# EAGLE design Arduino-Pro-Mini (EAGLE 7.3.0)
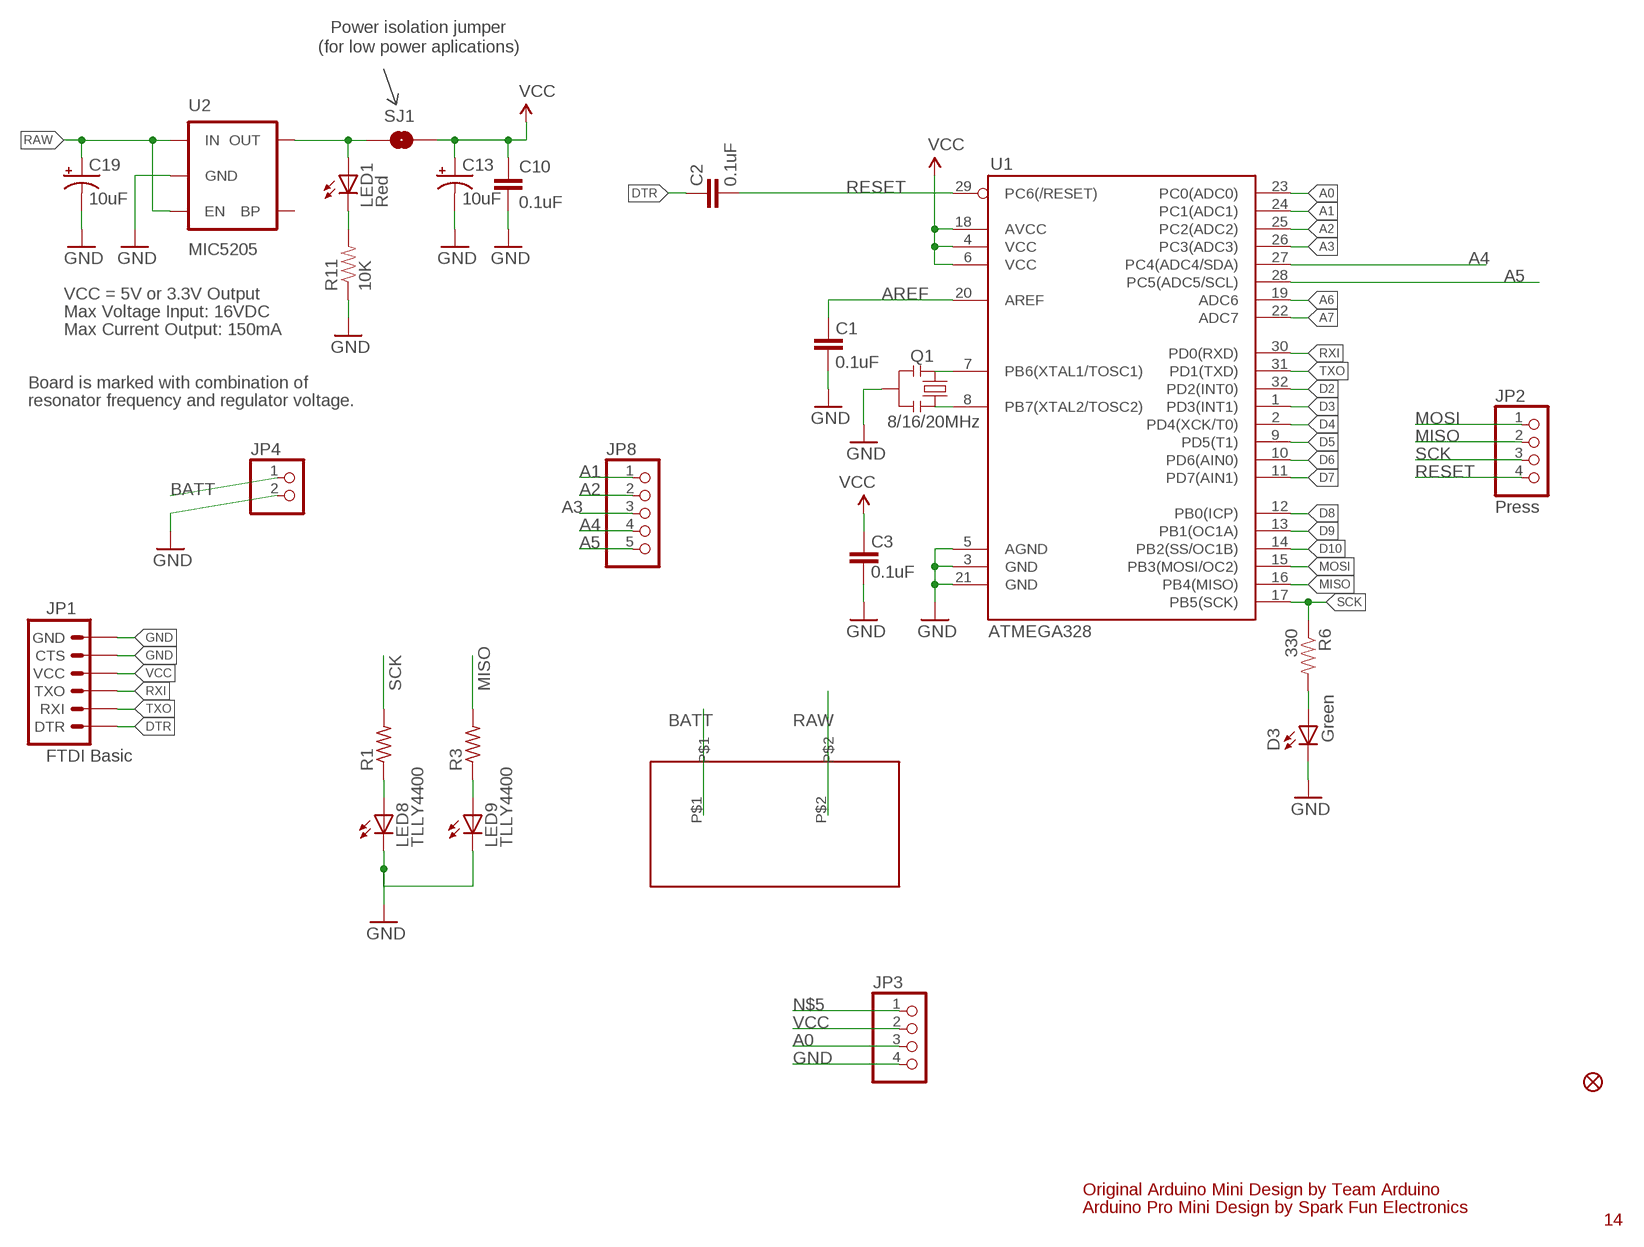
[diagram p0: schematic, sheet 1]

## Parts
C1  0.1uF  CAP0603-CAP  [0603-CAP]
C2  0.1uF  CAP0603-CAP  [0603-CAP]
C3  0.1uF  CAP0603-CAP  [0603-CAP]
C10  0.1uF  CAP0603-CAP  [0603-CAP]
C13  10uF  CAP_POL1206  [EIA3216]
C19  10uF  CAP_POL1206  [EIA3216]
D3  Green  LED  [0603-LED-ALT1]
JP1  FTDI Basic  ARDUINO_SERIAL_PROGRAMPTH  [1X06]
JP2  Press  PINHD-1X4  [1X04]
JP3  PINHD-1X4  [1X04]
JP4  PINHD-1X2  [1X02]
JP5  FIDUCIALUFIDUCIAL  [MICRO-FIDUCIAL]
JP8  PINHD-1X5  [1X05]
LED1  Red  LED  [0603-LED-ALT1]
LED8  TLLY4400  [LED3MM]
LED9  TLLY4400  [LED3MM]
Q1  8/16/20MHz  RESONATOR1:1  [RESONATOR-SMD-1:1]
R1  R-US_R0603  [R0603]
R3  R-US_R0603  [R0603]
R6  330  RESISTOR0603-RES  [0603-RES]
R11  10K  RESISTOR0603-RES  [0603-RES]
SJ1  SOLDERJUMPERNC  [SJ_2S]
U1  ATMEGA328  ATMEGA168  [TQFP32-08]
U2  MIC5205  V_REG_LDOSMD  [SOT23-5]
U$1  SWITCH-DW182  [SWITCH-CW182]

## Nets
A0: JP3.3 U1.23(PC0(ADC0))
A1: JP8.1 U1.24(PC1(ADC1))
A2: JP8.2 U1.25(PC2(ADC2))
A3: JP8.3 U1.26(PC3(ADC3))
A4: JP8.4 U1.27(PC4(ADC4/SDA))
A5: JP8.5 U1.28(PC5(ADC5/SCL))
A6: U1.19(ADC6)
A7: U1.22(ADC7)
AREF: C1.2 U1.20(AREF)
BATT [vcc]: JP4.1 U$1.P$1
D2: U1.32(PD2(INT0))
D3: U1.1(PD3(INT1))
D4: U1.2(PD4(XCK/T0))
D5: U1.9(PD5(T1))
D6: U1.10(PD6(AIN0))
D7: U1.11(PD7(AIN1))
D8: U1.12(PB0(ICP))
D9: U1.13(PB1(OC1A))
D10: U1.14(PB2(SS/OC1B))
DTR: C2.2 JP1.1(DTR)
GND [vcc]: C1.1 C3.1 C10.2 C13.C(-) C19.C(-) D3.C JP1.5(CTS) JP1.6(GND) JP3.4 JP4.2 LED8.K(C) LED9.K(C) Q1.2 R11.1 U1.3(GND) U1.5(AGND) U1.21(GND) U2.2(GND)
MISO: JP2.2 R3.2 U1.16(PB4(MISO))
MOSI: JP2.1 U1.15(PB3(MOSI/OC2))
N$1: Q1.3 U1.8(PB7(XTAL2/TOSC2))
N$2: Q1.1 U1.7(PB6(XTAL1/TOSC1))
N$3: LED1.A SJ1.1 U2.5(OUT)
N$4: LED1.C R11.2
N$5: JP3.1
N$7: D3.A R6.2
N$9: LED8.A R1.1
N$16: LED9.A R3.1
RAW [vcc]: C19.A(+) U2.1(IN) U2.3(EN) U$1.P$2
RESET: C2.1 JP2.4 U1.29(PC6(/RESET))
RXI: JP1.3(TXO) U1.30(PD0(RXD))
SCK: JP2.3 R1.2 R6.1 U1.17(PB5(SCK))
TXO: JP1.2(RXI) U1.31(PD1(TXD))
VCC: C3.2 C10.1 C13.A(+) JP1.4(VCC) JP3.2 SJ1.2 U1.4(VCC) U1.6(VCC) U1.18(AVCC)
Unconnected: U2.4(BP)

## Notes on the sheet
- Power isolation jumper
- (for low power aplications)
- VCC = 5V or 3.3V Output
- Max Voltage Input: 16VDC
- Max Current Output: 150mA
- Board is marked with combination of
- resonator frequency and regulator voltage.
- Original Arduino Mini Design by Team Arduino
- Arduino Pro Mini Design by Spark Fun Electronics
- 14

## Library data of the parts
C1-C3 C10 = SparkFun:CAP: Capacitor Standard 0603 ceramic capacitor, and 0.1" leaded capacitor.
C13 C19 = SparkFun:CAP_POL: Capacitor Polarized These are standard SMD and PTH capacitors. Normally 10uF, 47uF, and 100uF in electrolytic and tantalum varieties. Always verify the external diameter of the through hole cap, it varies with capacity, voltage, and manufacturer. The EIA devices should be standard.
D3 LED1 = Testing:LED: LEDs Standard schematic elements and footprints for 5mm, 3mm, 1206, and 0603 sized LEDs. 5mm - Spark Fun Electronics SKU : COM-00529 (and others)
JP1 = SparkFun:ARDUINO_SERIAL_PROGRAM
JP2 JP3 = pinhead:PINHD-1X4: PIN HEADER
JP4 = pinhead:PINHD-1X2: PIN HEADER
JP5 = SparkFun:FIDUCIAL: Fiducial Alignment Points Various fiducial points for machine vision alignment.
JP8 = pinhead:PINHD-1X5: PIN HEADER
LED8 LED9 = led:TLLY4400: Low Current (2mA) LED 3 mm Tinted Diffused Package color YELLOW Source: Data sheet <http://www.farnell.com/datasheets/391098.pdf>; MF: VISHAY SEMICONDUCTOR; OC_FARNELL: 1612439
Q1 = Testing:RESONATOR: Resonator Small SMD resonator. This is the itty bitty 10/20MHz resonators with built in caps. CSTCE10M0G55 and CSTCE20M0V53. Footprint for SMD has been used in SFE production for years, and does work okay. 1:1 is an attempt to get larger fillets on the sides so it will be easier to inspect these solders in our AOI machine. The pads have been minimized to match the actual metal under the resonator. To see this relation, it includes an image import of the bottom side of the component. Imported to scale on layer 200.
R1 R3 = resistor:R-US_: RESISTOR, American symbol
R6 R11 = SparkFun:RESISTOR: Resistor Basic schematic elements and footprints for 0603, 1206, and PTH resistors.
SJ1 = SparkFun-Passives:SOLDERJUMPER: Solder Jumper Standard SMD solder jumper. Used to automate production. Two varients : Normally Open and Normally Closed are the same, but have different paste layers. NC will have a large amount of paste and should jumper during reflow.
U1 = SparkFun:ATMEGA168
U2 = SparkFun:V_REG_LDO: Voltage Regulator LDO Standard 150mA LDO voltage regulator in SOT-23 layout. Micrel part MIC5205. BP (by-pass) pin is used to lower output noise with 470pF cap.
U$1 = real_deal:SWITCH-DW182

## Net classes
0 default: width 0.203 mm
1 vcc: width 0.254 mm

## Board
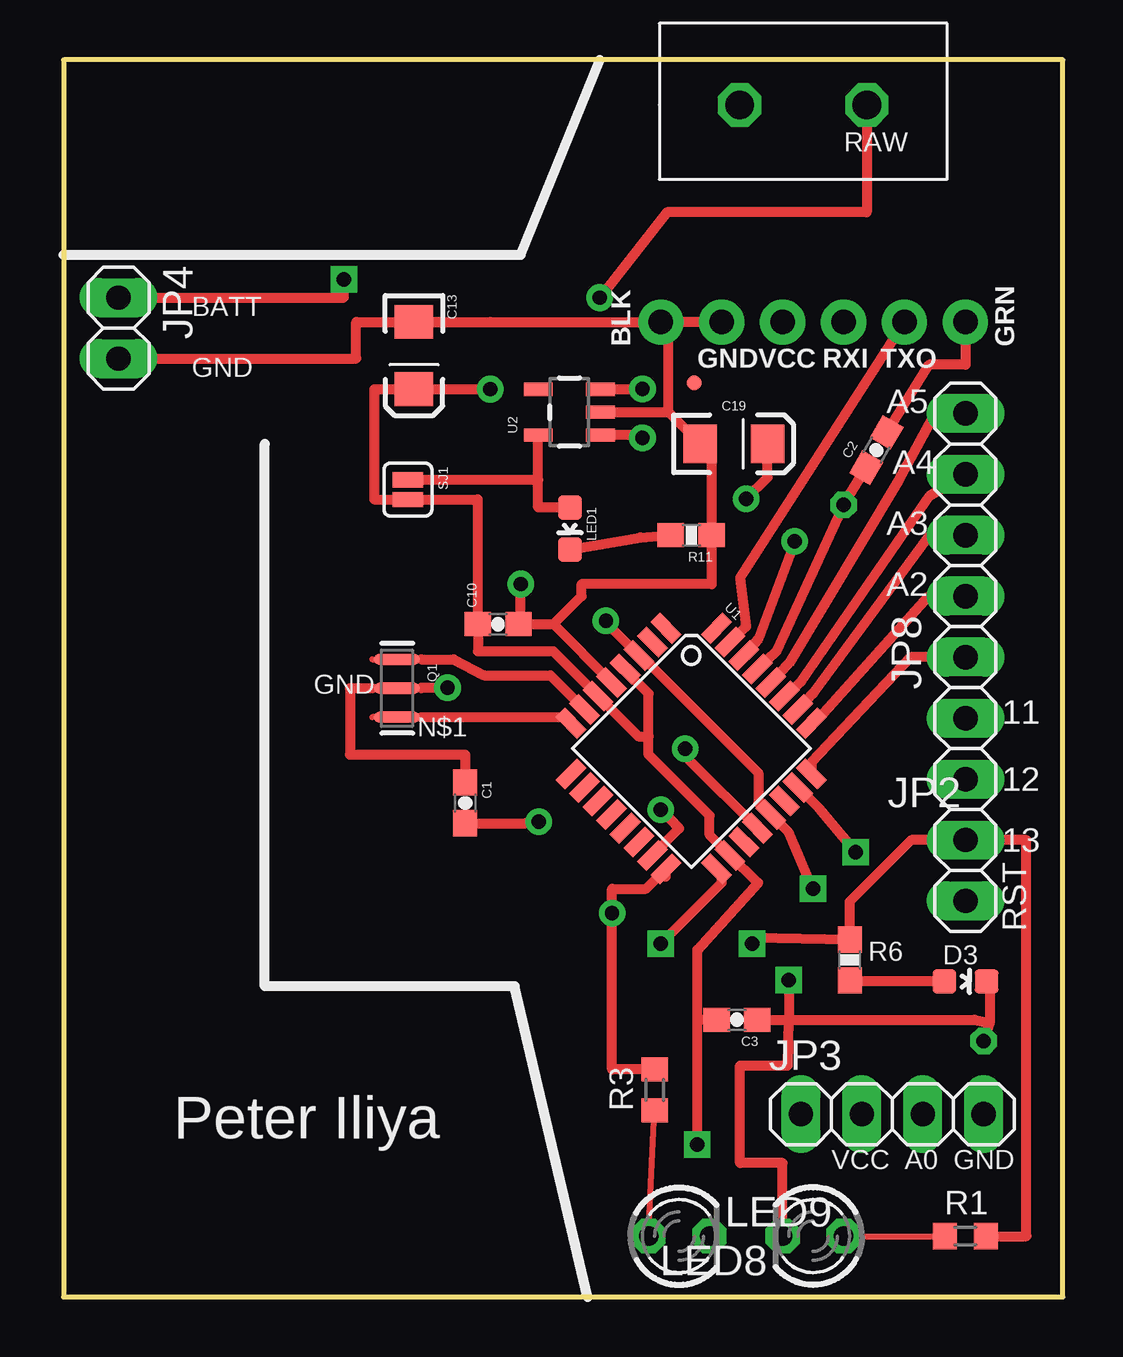
[diagram p1: board, top side]
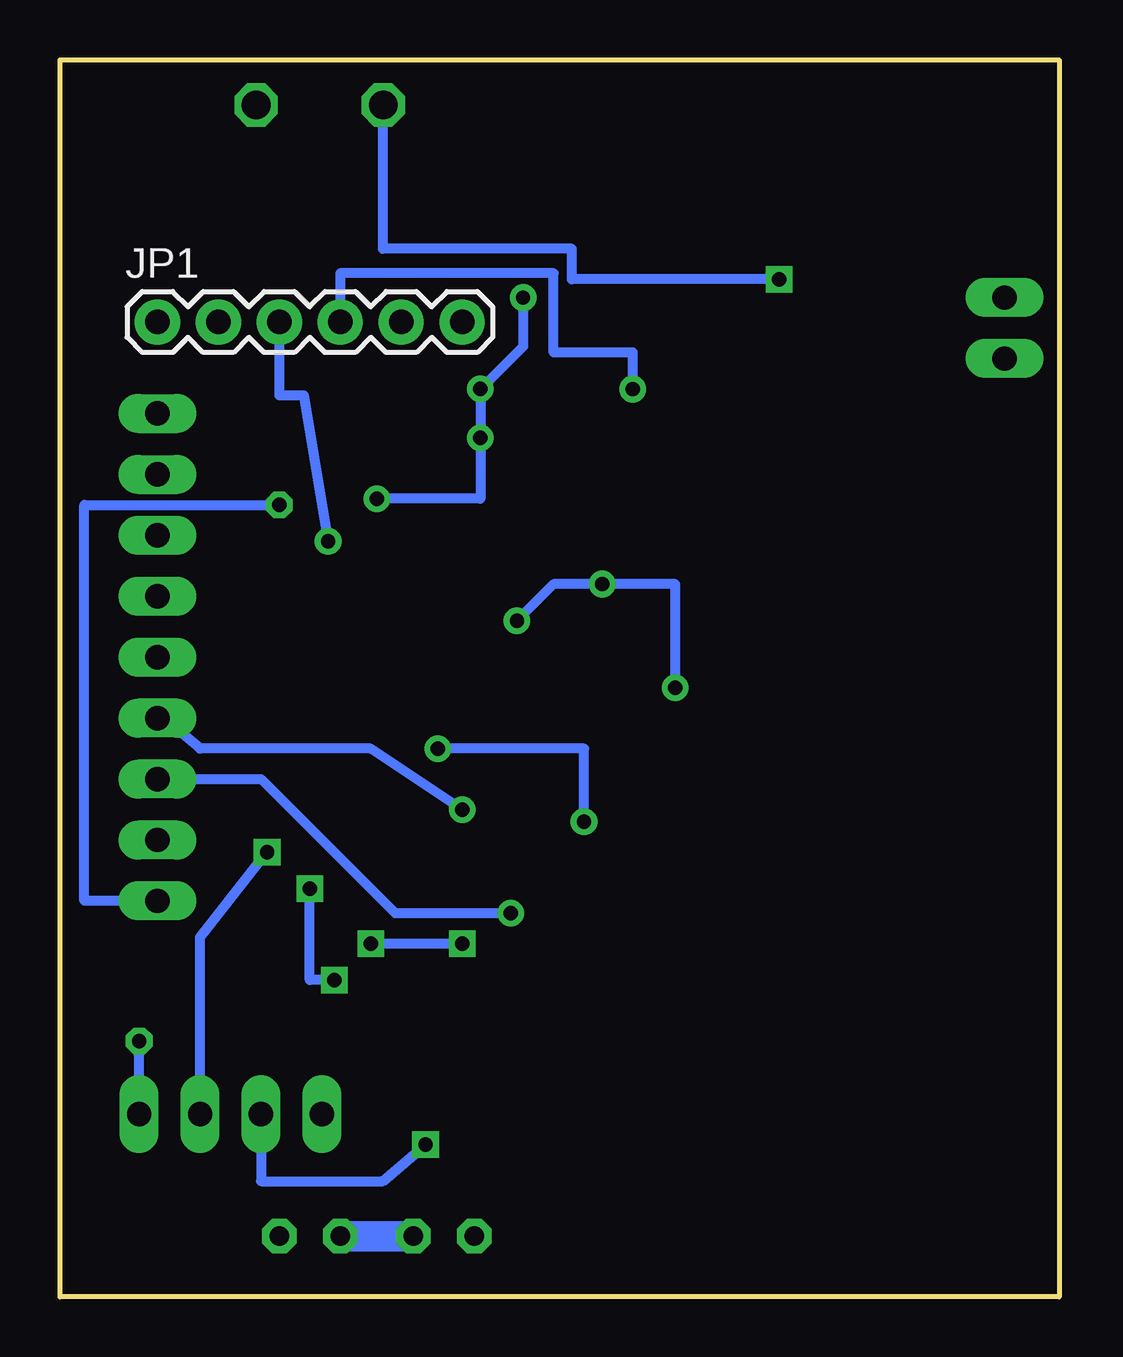
[diagram p2: board, bottom side, seen from below]

Size 41.66 x 51.56 mm. Coordinates in mm from the lower left corner, seen from the top.
Outline: 0,51.56 0,0 41.66,0 41.66,51.56 0,51.56
Copper layers (1*16): Top 0.035mm / dielectric 1.5mm / Bottom 0.035mm
Design rules "SparkFun-2-layer *": minimum track width 7mil, minimum drill 15mil, track to track 8mil, track to pad 8mil, pad to pad 8mil, via to via 8mil, smd to smd 8mil, copper to edge 8mil, drill to drill 8mil, minimum pad ring 12mil, minimum via ring 10mil, stop-mask expansion 4mil, vias tented up to drill 20mil, thermal gap 10mil

### Footprints (pad centres in the part's own frame; a part is rotated, then mirrored left to right if it is on the bottom)
0603-CAP = smd 1.1 x 1: 1 -0.85,0; 2 0.85,0
EIA3216 = smd 1.4 x 1.6: A 1.4,0; C -1.4,0
0603-LED-ALT1 = smd 1 x 1: A 0,-0.877; C 0,0.877
1X06 = drill 1.016 pad 1.88: 1 0,0; 2 2.54,0; 3 5.08,0; 4 7.62,0; 5 10.16,0; 6 12.7,0
1X04 = drill 1.016 long: 1 -3.81,0; 2 -1.27,0; 3 1.27,0; 4 3.81,0
1X02 = drill 1.016 long: 1 -1.27,0; 2 1.27,0
MICRO-FIDUCIAL = smd 0.635 x 0.635: 1 0,0
1X05 = drill 1.016 long: 1 -5.08,0; 2 -2.54,0; 3 0,0; 4 2.54,0; 5 5.08,0
LED3MM = drill 0.813 octagon: A -1.27,0; K 1.27,0
RESONATOR-SMD-1:1 = smd 0.45 x 1.905: 1 -1.2,0; 2 0,0; 3 1.2,0
R0603 = smd 1 x 1.1: 1 -0.85,0; 2 0.85,0
0603-RES = smd 1.1 x 1: 1 -0.85,0; 2 0.85,0
SJ_2S = smd 0.635 x 1.27: 1 -0.412,0; 2 0.412,0
TQFP32-08 = smd 1.27 x 0.559: 1 -4.293,2.8; 2 -4.293,2; 3 -4.293,1.2; 4 -4.293,0.4; 5 -4.293,-0.4; 6 -4.293,-1.2; 7 -4.293,-2; 8 -4.293,-2.8; 17 4.293,-2.8; 18 4.293,-2; 19 4.293,-1.2; 20 4.293,-0.4; 21 4.293,0.4; 22 4.293,1.2; 23 4.293,2; 24 4.293,2.8 | smd 0.559 x 1.27: 9 -2.8,-4.293; 10 -2,-4.293; 11 -1.2,-4.293; 12 -0.4,-4.293; 13 0.4,-4.293; 14 1.2,-4.293; 15 2,-4.293; 16 2.8,-4.293; 25 2.8,4.293; 26 2,4.293; 27 1.2,4.293; 28 0.4,4.293; 29 -0.4,4.293; 30 -1.2,4.293; 31 -2,4.293; 32 -2.8,4.293
SOT23-5 = smd 0.55 x 1.2: 1 -0.95,-1.3; 2 0,-1.3; 3 0.95,-1.3; 4 0.95,1.3; 5 -0.95,1.3
SWITCH-CW182 = drill 1.194 octagon: P$1 8.65,3.4; P$2 3.35,3.4

### Placement (x,y rotation side)
C1  16.74,20.6 270 top
C2  33.88,35.31 60 top
C3  28.07,11.56 180 top
C10  18.11,28.04 0 top
C13  14.61,39.24 270 top
C19  27.94,35.56 0 top
D3  37.59,13.16 270 top
JP1  37.59,40.64 0 bottom
JP2  37.59,20.32 270 top
JP3  34.54,7.62 0 top
JP4  2.29,40.39 270 top
JP5  26.29,38.1 0 top
JP8  37.59,31.75 90 top
LED1  21.11,32.03 180 top
LED8  31.24,2.54 180 top
LED9  25.65,2.54 0 top
Q1  13.89,25.37 270 top
R1  37.59,2.54 0 top
R3  24.64,8.64 90 top
R6  32.77,14.05 270 top
R11  26.16,31.75 180 top
SJ1  14.35,33.66 270 top
U1  26.16,22.86 315 top
U2  21.08,36.88 90 top
U$1  36.83,53.09 180 top

### Tracks (layer width: path | path; a pad name or v marks a point on that pad's centre or on a via)
A0  (via drill 0.6)
  Top 0.406: v33.02,18.54 31.5,20.35 U1.23
  Bottom 0.406: JP3.3 35.81,14.99 v33.02,18.54
A1
  Top 0.406: JP8.1 35.31,26.67 31.18,22.29 U1.24
A2
  Top 0.406: JP8.2 36.07,29.21 31.5,24.13 U1.25
A3
  Top 0.406: JP8.3 36.07,31.72 31.24,25.15 30.99,24.89 U1.26
A4
  Top 0.406: JP8.4 36.07,33.35 30.73,25.65 30.48,25.4 U1.27
A5
  Top 0.406: JP8.5 36.32,36.83 34.8,34.04 30.23,26.42 U1.28
AREF  (via drill 0.6)
  Top 0.406: C1.2 19.24,19.75 v19.81,19.81 | v25.91,22.86 26.1,22.35 U1.20
  Bottom 0.406: v19.81,19.81 19.81,22.86 v25.91,22.86
BATT  (via drill 0.6)
  Top 0.406: JP4.1 11.68,41.66 v11.68,42.42
  Bottom 0.406: v11.68,42.42 20.32,42.42 20.32,43.69 28.19,43.69 28.19,48.15 U$1.P$1
DTR
  Top 0.406: JP1.1 37.59,38.86 36.07,38.86 C2.2
GND  (via drill 0.6)
  Top 0.406: D3.C 38.61,13.16 38.61,11.43 | 38.61,11.43 v38.35,10.67 | JP4.2 12.19,39.12 12.19,40.64 15.62,40.64 C13.C 17.78,40.64 JP1.6 | 20.41,28.04 C10.2 19.05,28.13 v19.05,29.72 | 20.41,28.04 U1.5 | C1.1 16.74,22.61 11.94,22.61 11.94,25.38 12.88,25.38 | JP1.5 JP1.6 | LED8.K 29.97,5.59 28.19,5.59 28.19,9.65 30.19,9.65 30.23,11.56 | C3.1 30.23,11.56 | 30.23,11.56 37.97,11.56 38.61,11.43 | v31.24,17.02 30.23,19.36 U1.21 29.42,20.11 28.96,20.57 28.96,21.84 24.06,26.74 U1.3 22.61,28.11 v22.61,28.19 | 25.22,36.88 C19.C 27.01,35.09 R11.1 27.01,29.72 21.59,29.72 21.59,29.22 20.41,28.04 | U2.2 25.22,36.88 | 25.22,36.88 25.22,40.64 JP1.6 | 14.91,25.38 14.91,25.4 v16,25.4 | v30.23,13.21 30.23,11.56
  Bottom 0.406: JP3.4 v38.35,10.67 | v22.61,28.19 21.08,29.72 v19.05,29.72 16,29.72 v16,25.4 | v31.24,17.02 31.24,13.21 v30.23,13.21
  Bottom 1.27: LED9.K LED8.K
MISO  (via drill 0.6)
  Top 0.406: R3.2 22.86,9.49 v22.86,16 22.86,17.02 24.28,17.02 U1.16 25.11,17.53
  Bottom 0.406: JP2.2 33.27,21.59 27.69,16 v22.86,16
MOSI  (via drill 0.6)
  Top 0.406: U1.15 25.65,19.52 v24.89,20.32
  Bottom 0.406: v24.89,20.32 28.7,22.86 35.81,22.86 37.34,24.13 JP2.1
N$1
  Top 0.406: 14.91,24.17 20.89,24.17 U1.8
N$2
  Top 0.406: 14.91,26.58 16.26,26.58 17.53,25.91 20.29,25.91 U1.7
N$3
  Top 0.406: SJ1.1 19.78,34.07 | 19.78,34.07 U2.5 | LED1.A 19.78,32.91 19.78,34.07
N$4
  Top 0.406: LED1.C 24.04,31.66 R11.2
N$7
  Top 0.406: 32.54,13.16 R6.2 32.8,13.16 D3.A
N$9
  Top 0.254: LED8.A R1.1
N$16
  Top 0.254: LED9.A R3.1
RAW  (via drill 0.6)
  Top 0.406: U2.3 22.38,37.85 v24.13,37.85 | v24.13,35.81 24.13,35.93 U2.1 | U$1.P$2 33.48,45.21 25.15,45.21 v22.35,41.66 | v28.45,33.27 29.34,34.17 C19.A
  Bottom 0.406: v22.35,41.66 22.35,39.62 v24.13,37.85 v24.13,35.81 24.13,33.27 v28.45,33.27
RESET  (via drill 0.6)
  Top 0.406: C2.1 v32.51,33.02 29.72,26.92 U1.29
  Bottom 0.406: JP2.4 40.64,16.51 40.64,33.02 v32.51,33.02
RXI  (via drill 0.6)
  Top 0.406: v30.48,31.5 28.96,27.43 U1.30
  Bottom 0.406: JP1.3 32.51,37.59 31.5,37.59 v30.48,31.5
SCK  (via drill 0.6)
  Top 0.406: R1.2 40.13,2.54 40.13,19.05 JP2.3 35.33,19.05 32.77,16.48 R6.1 28.7,14.99 v28.7,14.73 | v24.89,14.73 27.43,17.27 27.43,17.63 U1.17
  Bottom 0.406: v28.7,14.73 v24.89,14.73
TXO
  Top 0.406: JP1.2 28.19,29.97 28.45,27.94 U1.31
VCC  (via drill 0.6)
  Top 0.406: v17.78,37.84 C13.A 12.95,37.84 12.95,33.24 SJ1.2 17.26,33.24 C10.1 17.27,26.92 20.4,26.92 U1.6 23.96,23.37 24.38,23.37 | C3.2 26.42,11.56 | 26.42,11.56 26.42,14.48 28.96,17.27 28.92,17.27 U1.18 26.92,19.27 26.92,20.07 24.38,22.61 24.38,23.37 | v26.42,6.35 26.42,11.56 | 24.38,23.37 24.38,25.15 23.41,26.12 U1.4
  Bottom 0.406: JP3.2 33.27,4.83 28.19,4.83 v26.42,6.35 | v17.78,37.84 17.78,39.37 21.08,39.37 21.08,42.67 29.97,42.67 JP1.4

### Text on the board
tPlace: BLK | GRN | GND | VCC | RXI | TXO
tNames: RAW | BATT | GND | A5 | A4 | A3 | A2 | GND | N$1 | 11 | 12 | 13 | RST | Peter Iliya | VCC | A0 | GND
tValues: Valid combinations: | 168V / 3.3V Reg / 8MHz | 168 / 5V Reg / 16MHz | 168 / 5V Reg / 20MHz | Mark back accordingly | Arduino Pro Mini
Reference: BATT